# Altium schematic sheet Sheet2.SchDoc
size A3; DocumentNumber: 2; SheetNumber: 2; SheetTotal: 6
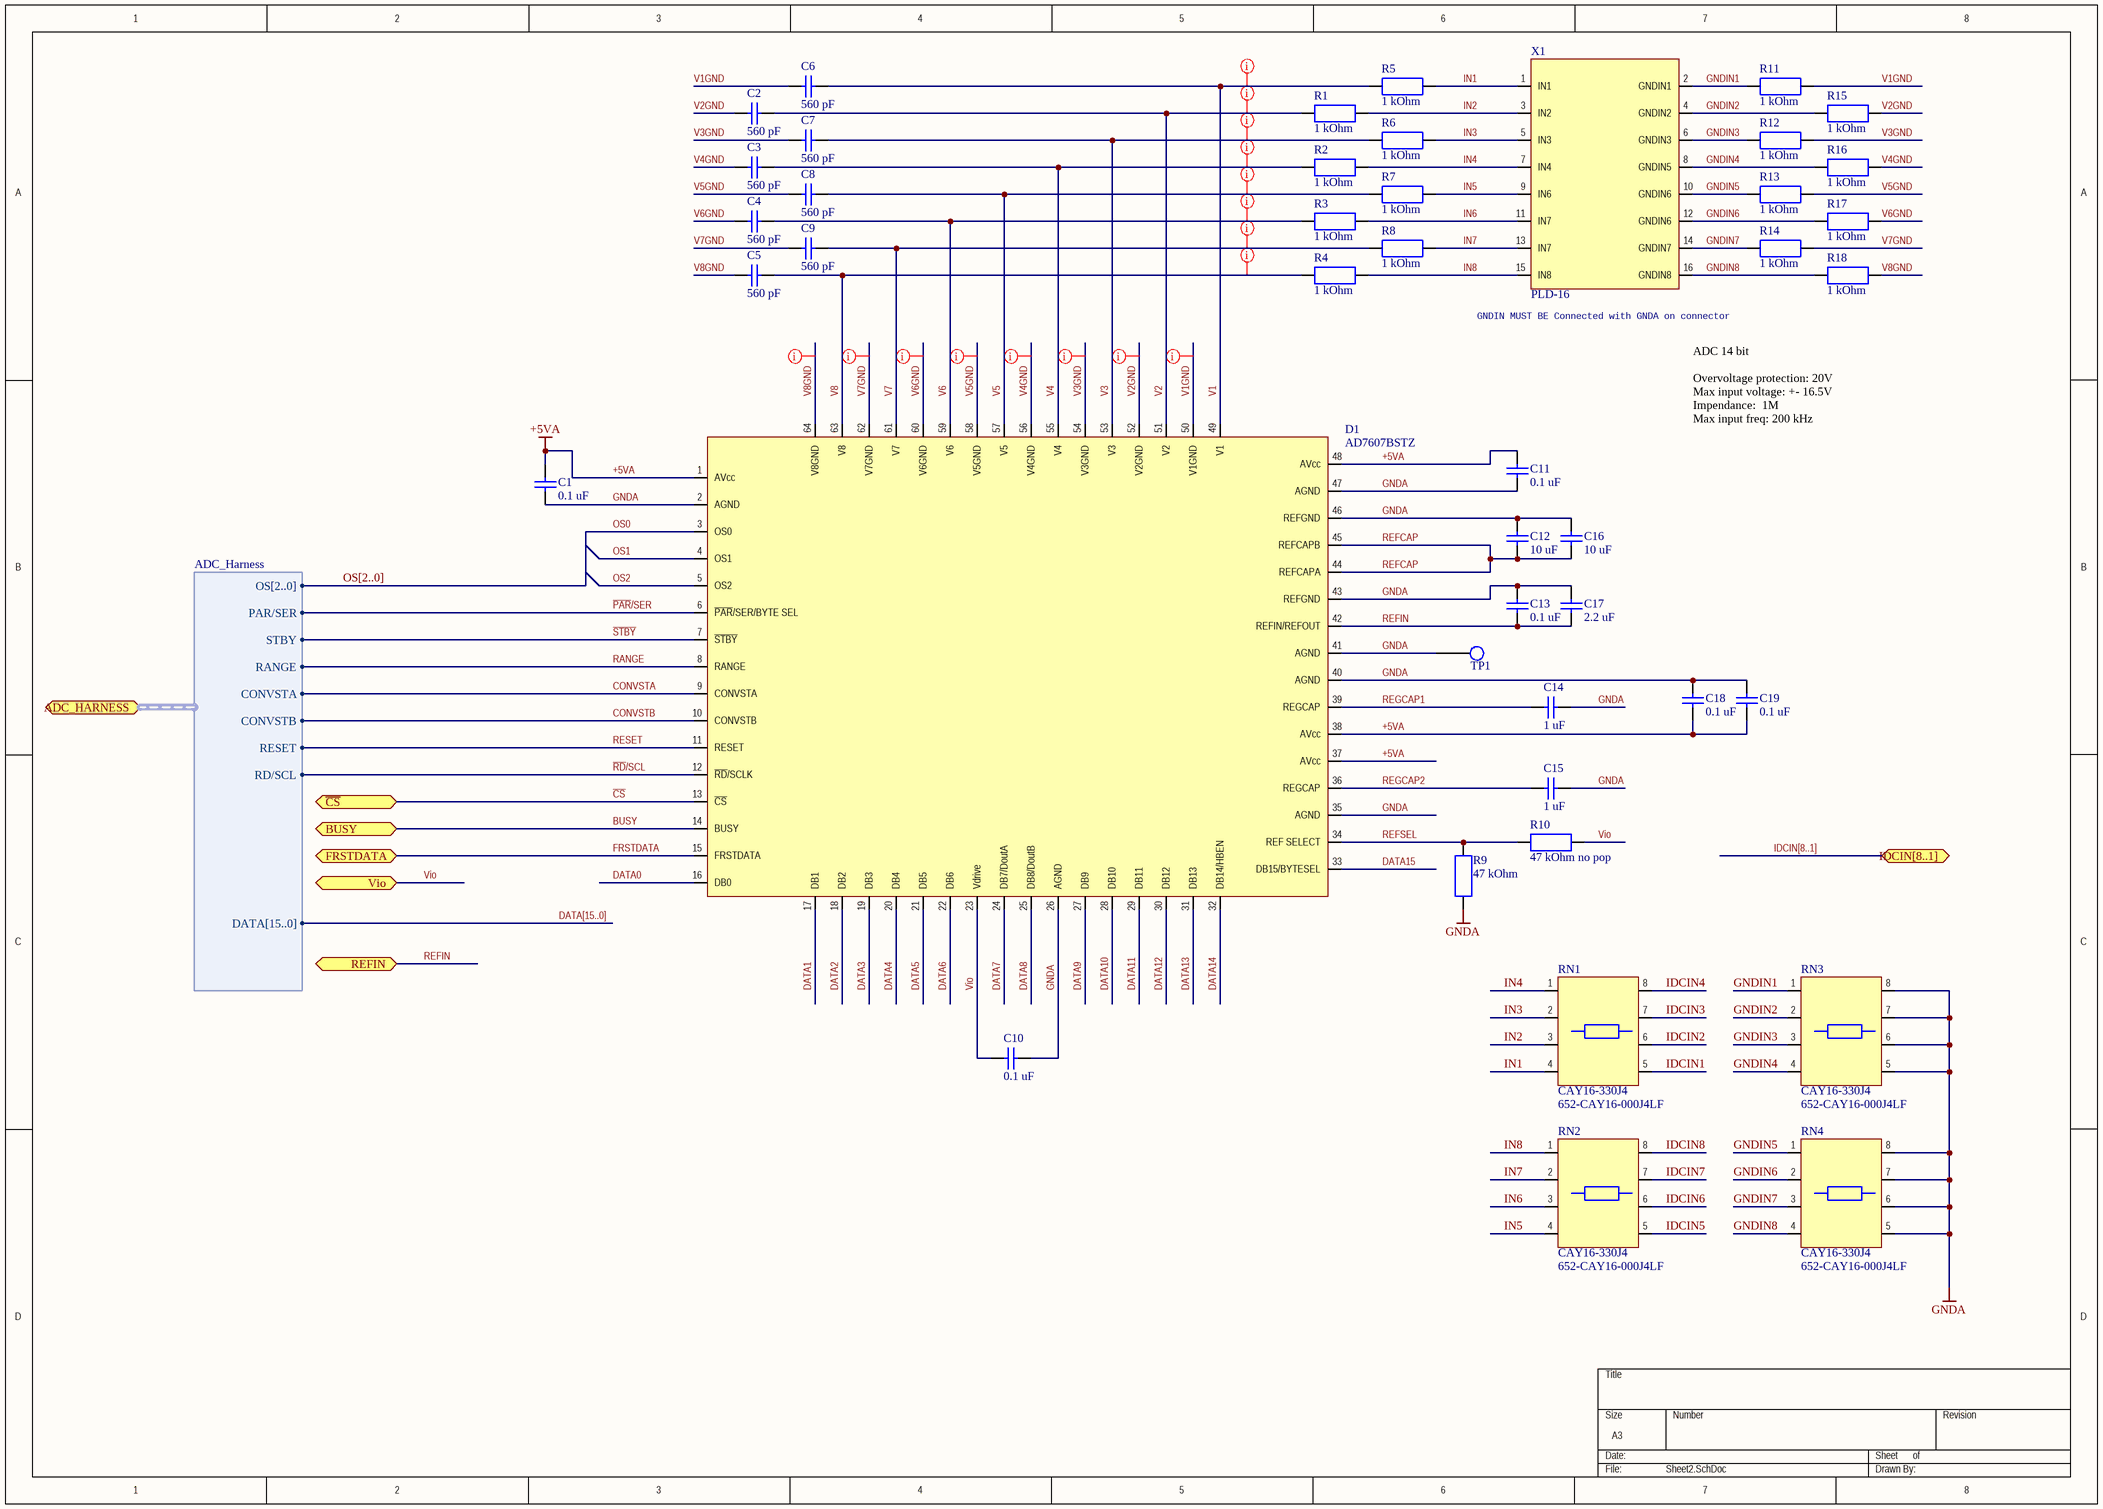
[diagram p0: Sheet2.SchDoc]

## Parts
C1  0.1 uF  [CAPC1608N]
C2  560 pF  [CAPC1608N]
C3  560 pF  [CAPC1608N]
C4  560 pF  [CAPC1608N]
C5  560 pF  [CAPC1608N]
C6  560 pF  [CAPC1608N]
C7  560 pF  [CAPC1608N]
C8  560 pF  [CAPC1608N]
C9  560 pF  [CAPC1608N]
C10  0.1 uF  [CAPC1608N]
C11  0.1 uF  [CAPC1608N]
C12  10 uF  [CAPC1608N]
C13  0.1 uF  [CAPC1608N]
C14  1 uF  [CAPC1608N]
C15  1 uF  [CAPC1608N]
C16  10 uF  [CAPC1608N]
C17  2.2 uF  [CAPC1608N]
C18  0.1 uF  [CAPC1608N]
C19  0.1 uF  [CAPC1608N]
D1  AD7607BSTZ  [TSQFP50P1200X1200X160-64N]
R1  1 kOhm  [RESC1608N]
R2  1 kOhm  [RESC1608N]
R3  1 kOhm  [RESC1608N]
R4  1 kOhm  [RESC1608N]
R5  1 kOhm  [RESC1608N]
R6  1 kOhm  [RESC1608N]
R7  1 kOhm  [RESC1608N]
R8  1 kOhm  [RESC1608N]
R9  47 kOhm  [RESC1608N]
R10  47 kOhm no pop  [RESC1608N]
R11  1 kOhm  [RESC1608N]
R12  1 kOhm  [RESC1608N]
R13  1 kOhm  [RESC1608N]
R14  1 kOhm  [RESC1608N]
R15  1 kOhm  [RESC1608N]
R16  1 kOhm  [RESC1608N]
R17  1 kOhm  [RESC1608N]
R18  1 kOhm  [RESC1608N]
RN1  CAY16-330J4  Supplier Part Number 1: 652-CAY16-000J4LF  [EXB38V]
RN2  CAY16-330J4  Supplier Part Number 1: 652-CAY16-000J4LF  [EXB38V]
RN3  CAY16-330J4  Supplier Part Number 1: 652-CAY16-000J4LF  [EXB38V]
RN4  CAY16-330J4  Supplier Part Number 1: 652-CAY16-000J4LF  [EXB38V]
TP1  PLS-1  [TPSW]  (value not drawn)
X1  PLD-16  [PLD-16]

## Ports
ADC_HARNESS (harness ADC_Harness), BUSY, FRSTDATA, IDCIN[8..1], REFIN, Vio, ~{CS}

## Harnesses
ADC_Harness: OS[2..0], PAR/SER, RANGE, STBY, CONVSTA, CONVSTB, RESET, RD/SCL, DATA[15..0]

## Nets
+5VA: C1.2 C11.2 C18.1 C19.1 D1.1(AVcc) D1.37(AVcc) D1.38(AVcc) D1.48(AVcc)
GNDA: C1.1 C10.1 C11.1 C12.2 C13.2 C14.1 C15.1 C16.2 C17.2 C18.2 C19.2 D1.2(AGND) D1.26(AGND) D1.35(AGND) D1.40(AGND) D1.41(AGND) D1.43(REFGND) D1.46(REFGND) D1.47(AGND) R9.1 RN3.5 RN3.6 RN3.7 RN3.8 RN4.5 RN4.6 RN4.7 RN4.8 TP1.1
BUSY: D1.14(BUSY) ; port BUSY
~{CS}: D1.13(~{CS}) ; port ~{CS}
CONVSTA: D1.9(CONVSTA) ; port ADC_HARNESS.CONVSTA
CONVSTB: D1.10(CONVSTB) ; port ADC_HARNESS.CONVSTB
DATA0: D1.16(DB0)
DATA1: D1.17(DB1)
DATA2: D1.18(DB2)
DATA3: D1.19(DB3)
DATA4: D1.20(DB4)
DATA5: D1.21(DB5)
DATA6: D1.22(DB6)
DATA7: D1.24(DB7/DoutA)
DATA8: D1.25(DB8/DoutB)
DATA9: D1.27(DB9)
DATA10: D1.28(DB10)
DATA11: D1.29(DB11)
DATA12: D1.30(DB12)
DATA13: D1.31(DB13)
DATA14: D1.32(DB14/HBEN)
DATA15: D1.33(DB15/BYTESEL)
FRSTDATA: D1.15(FRSTDATA) ; port FRSTDATA
GNDIN1: R11.1 RN3.1 X1.2(GNDIN1)
GNDIN2: R15.1 RN3.2 X1.4(GNDIN2)
GNDIN3: R12.1 RN3.3 X1.6(GNDIN3)
GNDIN4: R16.1 RN3.4 X1.8(GNDIN5)
GNDIN5: R13.1 RN4.1 X1.10(GNDIN6)
GNDIN6: R17.1 RN4.2 X1.12(GNDIN6)
GNDIN7: R14.1 RN4.3 X1.14(GNDIN7)
GNDIN8: R18.1 RN4.4 X1.16(GNDIN8)
IDCIN1: RN1.5
IDCIN2: RN1.6
IDCIN3: RN1.7
IDCIN4: RN1.8
IDCIN5: RN2.5
IDCIN6: RN2.6
IDCIN7: RN2.7
IDCIN8: RN2.8
IN1: R5.1 RN1.4 X1.1(IN1)
IN2: R1.1 RN1.3 X1.3(IN2)
IN3: R6.1 RN1.2 X1.5(IN3)
IN4: R2.1 RN1.1 X1.7(IN4)
IN5: R7.1 RN2.4 X1.9(IN6)
IN6: R3.1 RN2.3 X1.11(IN7)
IN7: R8.1 RN2.2 X1.13(IN7)
IN8: R4.1 RN2.1 X1.15(IN8)
OS0: D1.3(OS0)
OS1: D1.4(OS1)
OS2: D1.5(OS2)
~{PAR}/SER: D1.6(~{PAR}/SER/BYTE_SEL) ; port ADC_HARNESS.PAR/SER
~{RD}/SCL: D1.12(~{RD}/SCLK) ; port ADC_HARNESS.RD/SCL
RANGE: D1.8(RANGE) ; port ADC_HARNESS.RANGE
REFCAP: C12.1 C16.1 D1.44(REFCAPA) D1.45(REFCAPB)
REFIN: C13.1 C17.1 D1.42(REFIN/REFOUT) ; port REFIN
REFSEL: D1.34(REF_SELECT) R9.2 R10.2
REGCAP1: C14.2 D1.39(REGCAP)
REGCAP2: C15.2 D1.36(REGCAP)
RESET: D1.11(RESET) ; port ADC_HARNESS.RESET
~{STBY}: D1.7(~{STBY}) ; port ADC_HARNESS.STBY
V1: C6.2 D1.49(V1) R5.2
V1GND: C6.1 D1.50(V1GND) R11.2
V2: C2.2 D1.51(V2) R1.2
V2GND: C2.1 D1.52(V2GND) R15.2
V3: C7.2 D1.53(V3) R6.2
V3GND: C7.1 D1.54(V3GND) R12.2
V4: C3.2 D1.55(V4) R2.2
V4GND: C3.1 D1.56(V4GND) R16.2
V5: C8.2 D1.57(V5) R7.2
V5GND: C8.1 D1.58(V5GND) R13.2
V6: C4.2 D1.59(V6) R3.2
V6GND: C4.1 D1.60(V6GND) R17.2
V7: C9.2 D1.61(V7) R8.2
V7GND: C9.1 D1.62(V7GND) R14.2
V8: C5.2 D1.63(V8) R4.2
V8GND: C5.1 D1.64(V8GND) R18.2
Vio: C10.2 D1.23(Vdrive) R10.1 ; port Vio

## Buses and harness runs
bus DATA[15..0]
bus IDCIN[8..1] = port IDCIN[8..1]
bus OS[2..0]

## Layout directives
net class ANALOGIN: V1, V1GND, V2, V2GND, V3, V3GND, V4, V4GND, V5, V5GND, V6, V6GND, V7, V7GND, V8, V8GND

## Notes on the sheet
- (near X1) GNDIN MUST BE Connected with GNDA on connector
- ADC 14 bit
  Overvoltage protection: 20V
  Max input voltage: +- 16.5V
  Impendance:  1M
  Max input freq: 200 kHz

## Library data of the parts
C1-C19 = CC0603: ±10%, X7R, 0603; MaxVoltage: 10Vdc; Value: 1µF; Published: 2014; LatestRevisionDate: 2014; LatestRevisionNote: Re-released for DXP Platform.; PackageReference: RAD-0.3; Publisher: DS; PackageDescription: ChipCapasitor; HelpURL: http://product.tdk.com/capacitor/mlcc/en/documents/mlcc_commercial_general_en.pdf; Supplier 1: Digi-Key; Supplier Part Number 1: 445-4998-1-ND
D1 = AD7607BSTZ: AD7607BSTZ ADC Simultan; Supplier 1: Digi-Key; Supplier Part Number 1: AD7607BSTZ-ND
R1-R18 = RES0603: ±5%, 0603; MaxVoltage: 10Vdc; Value: 1µF; Published: 2014; LatestRevisionDate: 2014; LatestRevisionNote: Re-released for DXP Platform.; PackageReference: RAD-0.3; Publisher: DS; PackageDescription: ChipCapasitor; HelpURL: http://product.tdk.com/capacitor/mlcc/en/documents/mlcc_commercial_general_en.pdf
RN1-RN4 = CAY16: 0 Ohm; Supplier 1: Mouser
X1 = ADCIN: ADC connector